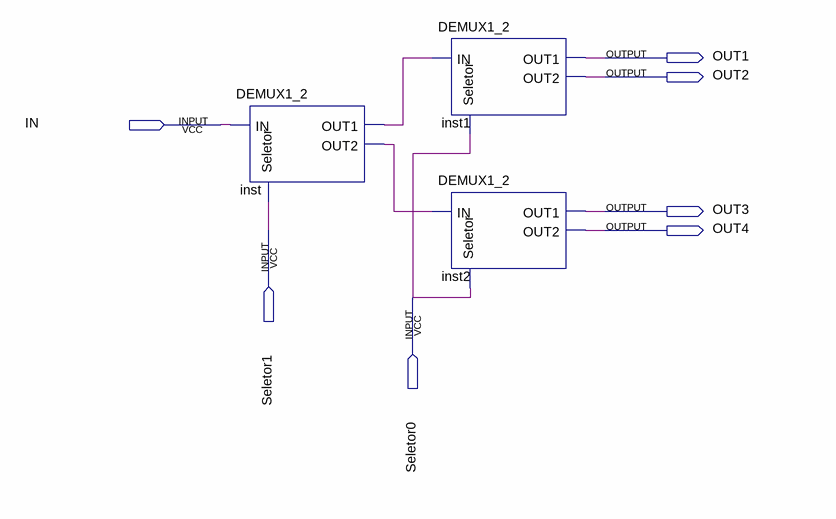
[diagram p0: schematic sheet]
// Quartus schematic DEMUX2_4.bdf as structural Verilog: 3 symbols, 7 pins
module DEMUX2_4 (
  input  IN,
  input  Seletor1,
  input  Seletor0,
  output OUT1,
  output OUT2,
  output OUT3,
  output OUT4
);

  wire inst_out1, inst_out2;

  DEMUX1_2 inst (.IN(IN), .Seletor(Seletor1), .OUT1(inst_out1), .OUT2(inst_out2));
  DEMUX1_2 inst1 (.IN(inst_out1), .Seletor(Seletor0), .OUT1(OUT1), .OUT2(OUT2));
  DEMUX1_2 inst2 (.IN(inst_out2), .Seletor(Seletor0), .OUT1(OUT3), .OUT2(OUT4));
endmodule
